# EAGLE design p7.1_3v3 (EAGLE 9.3.0)
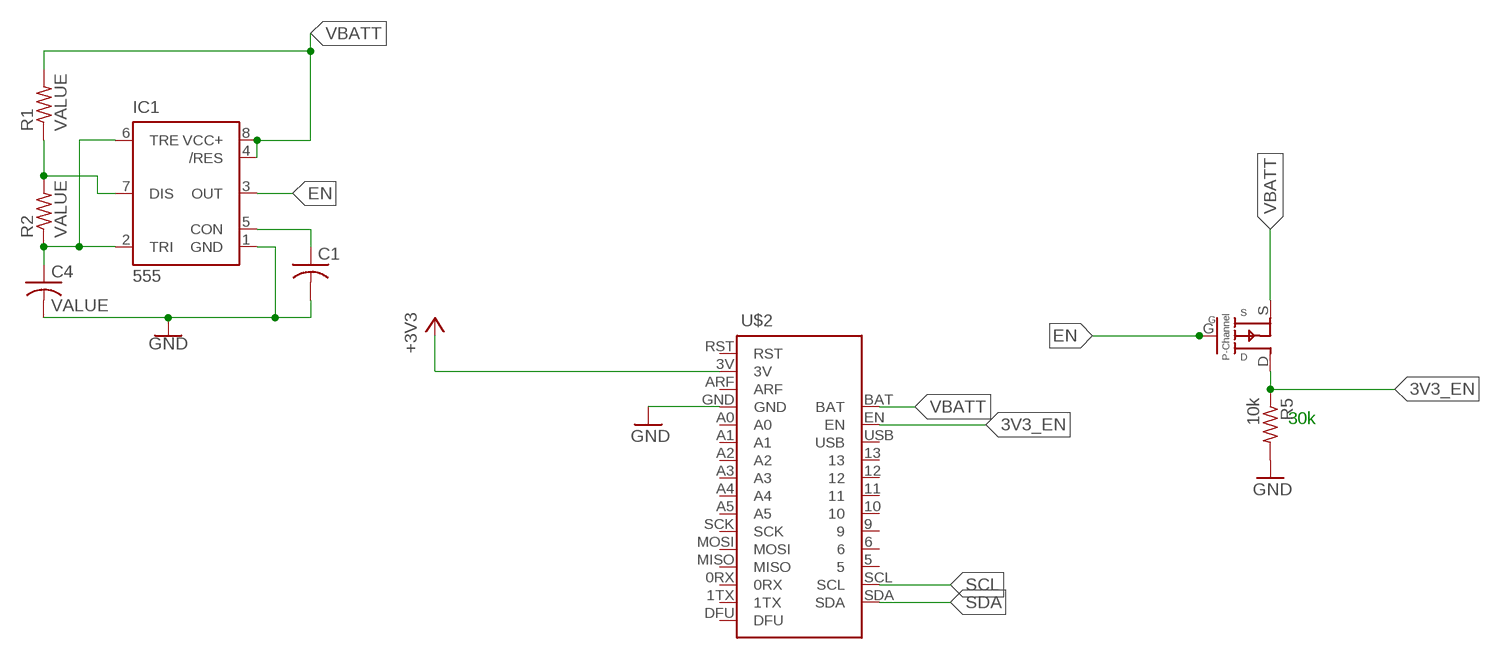
[diagram p0: schematic, sheet 1]

## Parts
C1  C-USC1206  [C1206]
C4  VALUE  C-USC1206  [C1206]
IC1  555  555P  [DIP08]
Q2  SSM3J3228R  [SOT-23-3]
R1  VALUE  R-US_R1206  [R1206]
R2  VALUE  R-US_R1206  [R1206]
R5  10k  R-US_R1206  [R1206]
U$2  BLUEFRUIT_M0  [BLUEFRUIT_MO]

## Nets
3V3_EN: Q2.D R5.1 U$2.EN
+3V3: U$2.3V
EN: IC1.3(OUT) Q2.G
GND: C1.2 C4.2 IC1.1(GND) R5.2 U$2.GND
N$1: C4.1 IC1.2(TRI) IC1.6(TRE) R2.1
N$3: IC1.7(DIS) R1.1 R2.2
N$7: C1.1 IC1.5(CON)
SCL: U$2.SCL
SDA: U$2.SDA
VBATT [sig]: IC1.4(/RES) IC1.8(VCC+) Q2.S R1.2 U$2.BAT
Unconnected: U$2.0RX U$2.1TX U$2.5 U$2.6 U$2.9 U$2.10 U$2.11 U$2.12 U$2.13 U$2.A0 U$2.A1 U$2.A2 U$2.A3 U$2.A4 U$2.A5 U$2.ARF U$2.DFU U$2.MISO U$2.MOSI U$2.RST U$2.SCK U$2.USB

## Notes on the sheet
- 30k

## Library data of the parts
C1 C4 = adafruit:C-US: CAPACITOR, American symbol
IC1 = SparkFun-IC-Special-Function:555: General purpose bipolar Timer Datasheet <http://www.sparkfun.com/datasheets/Components/General/ne555.pdf> SparkFun Products SparkFun SparkPunk Sequencer Kit <https://www.sparkfun.com/products/12707> (KIT-12707) Storefront Component: 555 Timer <https://www.sparkfun.com/products/9273> (COM-09273) Two parts valid for production: VFP: IC-11930 (M7555 PTH) VFP: IC-09173 (555 PTH) - Preferred; PROD_ID: IC-09173; PROD_ID_ALT: IC-09173
Q2 = M0_Power:SSM3J3228R: P-Channel MOSFET, SOT-23-3 SMD Package
R1 R2 R5 = adafruit:R-US_: RESISTOR, American symbol
U$2 = bluefruit_m0:BLUEFRUIT_M0: Adafruit's M0 Bluefruit / Bluetooth board layout

## Net classes
3 sig: width 0.152 mm, clearance 0.152 mm

## Board
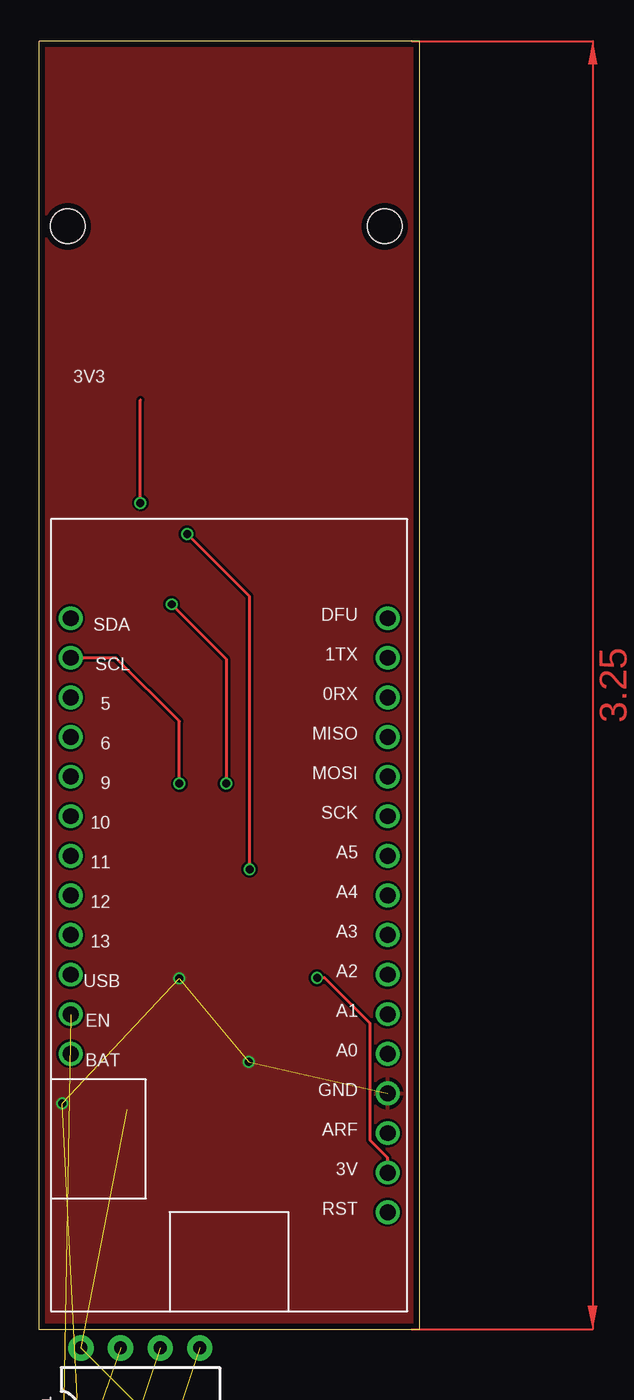
[diagram p1: board, top side]
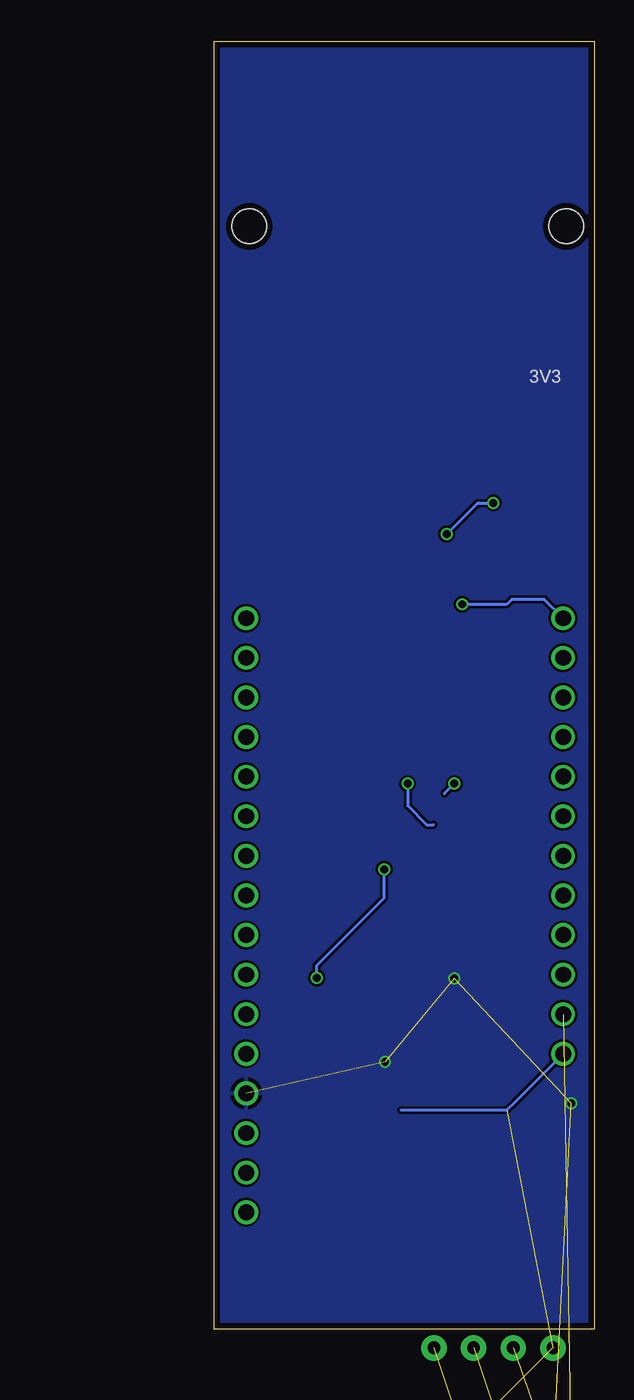
[diagram p2: board, bottom side, seen from below]

Size 24.41 x 82.63 mm. Coordinates in mm from the lower left corner, seen from the top.
Outline: 0,0 24.41,0 24.41,82.63 0.01,82.63
Outline: 0.01,0 0.01,82.63
Copper layers (1*16): Top 0.035559375mm / dielectric 1.6mm / Bottom 0.035559375mm
Design rules "oshpark-2layer": minimum track width 6mil, minimum drill 10mil, track to track 6mil, track to pad 6mil, pad to pad 6mil, via to via 6mil, smd to smd 6mil, copper to edge 15mil, drill to drill 6mil, minimum pad ring 5mil, minimum via ring 5mil, stop-mask expansion 2.5mil, vias tented up to drill 0mil, thermal gap 10mil
Holes 2.2 mm at 22.16,70.74 1.84,70.74

### Footprints (pad centres in the part's own frame; a part is rotated, then mirrored left to right if it is on the bottom)
C1206 = smd 1.6 x 1.8: 1 -1.4,0; 2 1.4,0
DIP08 = drill 0.813 pad 1.626: 1 -3.81,-3.81; 2 -1.27,-3.81; 3 1.27,-3.81; 4 3.81,-3.81; 5 3.81,3.81; 6 1.27,3.81; 7 -1.27,3.81; 8 -3.81,3.81
SOT-23-3 = smd 0.8 x 0.6: D 1.2,0; G -1.2,0.95; S -1.2,-0.95
R1206 = smd 1.6 x 1.803: 1 -1.422,0; 2 1.422,0
BLUEFRUIT_MO = drill 1.016: 0RX 39.37,1.27; 1TX 41.91,1.27; 3V 8.89,1.27; 5 39.37,21.59; 6 36.83,21.59; 9 34.29,21.59; 10 31.75,21.59; 11 29.21,21.59; 12 26.67,21.59; 13 24.13,21.59; A0 16.51,1.27; A1 19.05,1.27; A2 21.59,1.27; A3 24.13,1.27; A4 26.67,1.27; A5 29.21,1.27; ARF 11.43,1.27; BAT 16.51,21.59; DFU 44.45,1.27; EN 19.05,21.59; GND 13.97,1.27; MISO 36.83,1.27; MOSI 34.29,1.27; RST 6.35,1.27; SCK 31.75,1.27; SCL 41.91,21.59; SDA 44.45,21.59; USB 21.59,21.59

### Placement (x,y rotation side)
C1  2.5,-29 0 top  (outside the outline)
C4  2.5,-17 0 top  (outside the outline)
IC1  6.5,-5 0 top
Q2  2.5,-38.5 0 top  (outside the outline)
R1  2.5,-13 0 top  (outside the outline)
R2  2.5,-23 0 top  (outside the outline)
R5  2.5,-33 0 top  (outside the outline)
U$2  23.62,1.16 90 top

### Tracks (layer width: path | path; a pad name or v marks a point on that pad's centre or on a via)
3V3_EN  (2 unrouted)
+3V3  (via drill 0.51)
  Top 0.203: v17.83,22.54 18.32,22.54 21.23,19.62 21.23,12.12 22.35,11.01 U$2.3V | v13.5,29.5 13.5,47 v9.5,51 | v6.5,53 6.5,59.61
  Bottom 0.203: v17.83,22.54 17.83,23.33 13.5,27.66 v13.5,29.5 | v9.5,51 7.5,53 v6.5,53
EN  (1 unrouted)
GND  (via drill 0.51)  (7 unrouted)
  other vias: 1.5,14.5 13.45,17.14 9,22.5
  pour Top: 0,0 0,83 25,83 24.64,0
  pour Bottom: 0,83 25,83 25,0 0,0
N$1  (3 unrouted)
N$3  (2 unrouted)
N$7  (1 unrouted)
SCL  (via drill 0.51)
  Top 0.203: v9,35 9,39 4.93,43.07 U$2.SCL
  Bottom 0.203: 9.64,34.36 v9,35
SDA  (via drill 0.51)
  Top 0.203: v8.5,46.5 12,43 v12,35
  Bottom 0.203: v8.5,46.5 5.65,46.5 5.34,46.81 3.24,46.81 U$2.SDA | 10.34,32.35 10.76,32.35 12,33.59 v12,35
VBATT  (4 unrouted)
  Bottom 0.203: 12.44,14.06 5.64,14.06 5.1,14.6 U$2.BAT
(copper drawn outside any net)
  shapes: Top area x1

### Text on the board
tPlace: 3V3
bPlace: 3V3